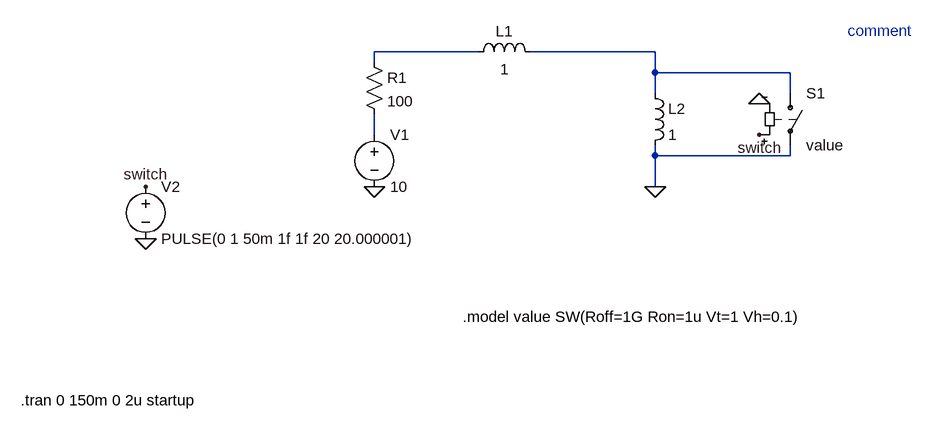
[diagram p0: schematic test.asc]
test.asc, the LTspice schematic file:
Version 4
SHEET 1 1048 680
WIRE 320 -48 160 -48
WIRE 592 -48 400 -48
WIRE 160 -32 160 -48
WIRE 592 -16 592 -48
WIRE 800 -16 592 -16
WIRE 592 16 592 -16
WIRE 800 16 800 -16
WIRE 160 80 160 48
WIRE 592 112 592 96
WIRE 800 112 800 96
WIRE 800 112 592 112
WIRE 592 160 592 112
FLAG 160 160 0
FLAG 592 160 0
FLAG 752 32 0
FLAG -192 240 0
FLAG -192 160 switch
FLAG 752 80 switch
SYMBOL voltage 160 64 R0
WINDOW 123 0 0 Left 0
WINDOW 39 0 0 Left 0
SYMATTR InstName V1
SYMATTR Value 10
SYMBOL sw 800 0 R0
SYMATTR InstName S1
SYMATTR Value value
SYMBOL res 144 -48 R0
SYMATTR InstName R1
SYMATTR Value 100
SYMBOL ind 304 -32 R270
WINDOW 0 32 56 VTop 2
WINDOW 3 5 56 VBottom 2
SYMATTR InstName L1
SYMATTR Value 1
SYMBOL ind 576 0 R0
SYMATTR InstName L2
SYMATTR Value 1
SYMBOL voltage -192 144 R0
WINDOW 123 0 0 Left 0
WINDOW 39 0 0 Left 0
SYMATTR InstName V2
SYMATTR Value PULSE(0 1 50m 1f 1f 20 20.000001)
TEXT -384 488 Left 2 !.tran 0 150m 0 2u startup
TEXT 888 -80 Left 2 ;comment
TEXT 296 360 Left 2 !.model value SW(Roff=1G Ron=1u Vt=1 Vh=0.1)

The netlist it stands for:
* test.asc
V1 N003 0 10
S1 N002 0 switch 0 value
R1 N001 N003 100
L1 N001 N002 1
L2 N002 0 1
V2 switch 0 PULSE(0 1 50m 1f 1f 20 20.000001)
.tran 0 150m 0 2u startup
* comment
.model value SW(Roff=1G Ron=1u Vt=1 Vh=0.1)
.backanno
.end